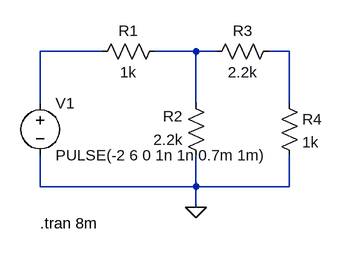
[diagram p0: schematic Draft3.asc]
Draft3.asc, the LTspice schematic file:
Version 4.1
SHEET 1 880 680
WIRE 176 64 80 64
WIRE 320 64 256 64
WIRE 352 64 320 64
WIRE 464 64 432 64
WIRE 80 144 80 64
WIRE 320 144 320 64
WIRE 464 144 464 64
WIRE 80 272 80 224
WIRE 320 272 320 224
WIRE 320 272 80 272
WIRE 464 272 464 224
WIRE 464 272 320 272
WIRE 320 304 320 272
FLAG 320 304 0
SYMBOL voltage 80 128 R0
WINDOW 123 0 0 Left 0
WINDOW 39 0 0 Left 0
SYMATTR InstName V1
SYMATTR Value PULSE(-2 6 0 1n 1n 0.7m 1m)
SYMBOL res 272 48 R90
WINDOW 0 0 56 VBottom 2
WINDOW 3 32 56 VTop 2
SYMATTR InstName R1
SYMATTR Value 1k
SYMBOL res 336 240 R180
WINDOW 0 36 76 Left 2
WINDOW 3 36 40 Left 2
SYMATTR InstName R2
SYMATTR Value 2.2k
SYMBOL res 336 80 R270
WINDOW 0 32 56 VTop 2
WINDOW 3 0 56 VBottom 2
SYMATTR InstName R3
SYMATTR Value 2.2k
SYMBOL res 448 128 R0
SYMATTR InstName R4
SYMATTR Value 1k
TEXT 80 328 Left 2 !.tran 8m

The netlist it stands for:
* Draft3.asc
V1 N001 0 PULSE(-2 6 0 1n 1n 0.7m 1m)
R1 N002 N001 1k
R2 0 N002 2.2k
R3 N002 N003 2.2k
R4 N003 0 1k
.tran 8m
.backanno
.end